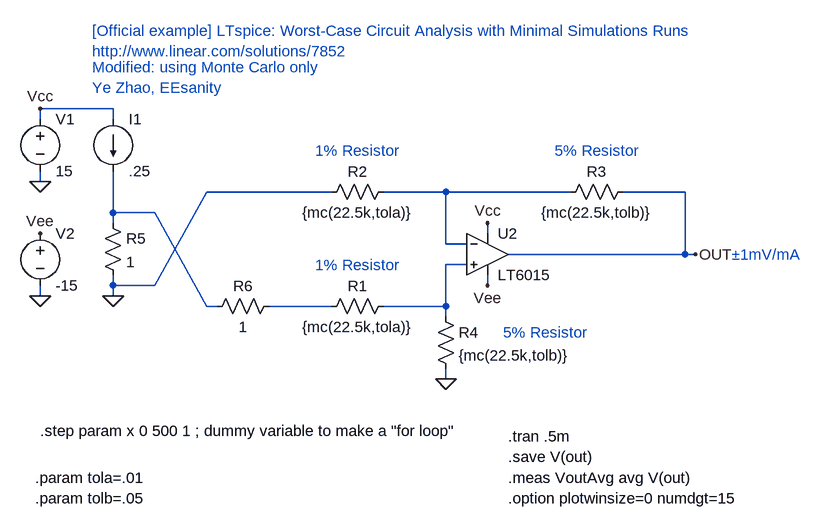
[diagram p0: schematic LTspice 07-3 Monte Carlo.asc]
LTspice 07-3 Monte Carlo.asc, the LTspice schematic file:
Version 4
SHEET 1 1820 680
WIRE -464 -752 -576 -752
WIRE -576 -736 -576 -752
WIRE -464 -736 -464 -752
WIRE -576 -640 -576 -656
WIRE -128 -624 -320 -624
WIRE 48 -624 -48 -624
WIRE 240 -624 48 -624
WIRE 416 -624 320 -624
WIRE -464 -592 -464 -656
WIRE -400 -592 -464 -592
WIRE -464 -576 -464 -592
WIRE 112 -560 112 -576
WIRE 48 -544 48 -624
WIRE 80 -544 48 -544
WIRE 416 -528 416 -624
WIRE 416 -528 144 -528
WIRE 432 -528 416 -528
WIRE 80 -512 48 -512
WIRE -464 -480 -464 -496
WIRE -400 -480 -320 -624
WIRE -400 -480 -464 -480
WIRE 112 -480 112 -496
WIRE -576 -464 -576 -480
WIRE -464 -464 -464 -480
WIRE -320 -448 -400 -592
WIRE -304 -448 -320 -448
WIRE -128 -448 -224 -448
WIRE 48 -448 48 -512
WIRE 48 -448 -48 -448
WIRE 48 -432 48 -448
WIRE 48 -336 48 -352
FLAG 48 -336 0
FLAG 432 -528 OUT
FLAG -576 -464 0
FLAG -576 -640 0
FLAG -576 -752 Vcc
FLAG -576 -560 Vee
FLAG 112 -576 Vcc
FLAG 112 -480 Vee
FLAG -464 -464 0
SYMBOL res -144 -432 R270
WINDOW 0 32 56 VTop 2
WINDOW 3 0 56 VBottom 2
SYMATTR InstName R1
SYMATTR Value {mc(22.5k,tola)}
SYMBOL res 32 -448 R0
SYMATTR InstName R4
SYMATTR Value {mc(22.5k,tolb)}
SYMBOL res 336 -640 R90
WINDOW 0 0 56 VBottom 2
WINDOW 3 32 56 VTop 2
SYMATTR InstName R3
SYMATTR Value {mc(22.5k,tolb)}
SYMBOL res -144 -608 R270
WINDOW 0 32 56 VTop 2
WINDOW 3 0 56 VBottom 2
SYMATTR InstName R2
SYMATTR Value {mc(22.5k,tola)}
SYMBOL Opamps\\LT6015 112 -528 R0
SYMATTR InstName U2
SYMBOL voltage -576 -752 R0
WINDOW 123 0 0 Left 2
WINDOW 39 0 0 Left 2
SYMATTR InstName V1
SYMATTR Value 15
SYMBOL voltage -576 -576 R0
WINDOW 123 0 0 Left 2
WINDOW 39 0 0 Left 2
SYMATTR InstName V2
SYMATTR Value -15
SYMBOL current -464 -736 R0
WINDOW 123 24 122 Left 2
WINDOW 39 24 101 Left 2
SYMATTR InstName I1
SYMATTR Value .25
SYMBOL res -480 -592 R0
SYMATTR InstName R5
SYMATTR Value 1
SYMBOL res -208 -464 R90
WINDOW 0 0 56 VBottom 2
WINDOW 3 32 56 VTop 2
SYMATTR InstName R6
SYMATTR Value 1
TEXT -584 -184 Left 2 !.param tola=.01
TEXT -584 -152 Left 2 !.param tolb=.05
TEXT 144 -248 Left 2 !.tran .5m
TEXT 144 -216 Left 2 !.save V(out)
TEXT 144 -184 Left 2 !.meas VoutAvg avg V(out)
TEXT 144 -152 Left 2 !.option plotwinsize=0 numdgt=15
TEXT 136 -408 Left 2 ;5% Resistor
TEXT 280 -672 Bottom 2 ;5% Resistor
TEXT -88 -672 Bottom 2 ;1% Resistor
TEXT -88 -496 Bottom 2 ;1% Resistor
TEXT 488 -528 Left 2 ;±1mV/mA
TEXT -576 -256 Left 2 !.step param x 0 500 1 ; dummy variable to make a "for loop"
TEXT -496 -872 Left 2 ;[Official example] LTspice: Worst-Case Circuit Analysis with Minimal Simulations Runs \nhttp://www.linear.com/solutions/7852
TEXT -496 -816 Left 2 ;Modified: using Monte Carlo only\nYe Zhao, EEsanity

The netlist it stands for:
* LTspice 07-3 Monte Carlo.asc
R1 N004 N003 {mc(22.5k,tola)}
R4 N003 0 {mc(22.5k,tolb)}
R3 OUT N001 {mc(22.5k,tolb)}
R2 0 N001 {mc(22.5k,tola)}
XU2 N003 N001 Vcc Vee OUT LT6016  ; LT6015, pins In+ In- V+ V- OUT
V1 Vcc 0 15
V2 Vee 0 -15
I1 Vcc N002 .25
R5 N002 0 1
R6 N004 N002 1
.param tola=.01
.param tolb=.05
.tran .5m
.save V(out)
.meas VoutAvg avg V(out)
.option plotwinsize=0 numdgt=15
* 5% Resistor
* 5% Resistor
* 1% Resistor
* 1% Resistor
* ±1mV/mA
.step param x 0 500 1 ; dummy variable to make a "for loop"
* [Official example] LTspice: Worst-Case Circuit Analysis with Minimal Simulations Runs
* http://www.linear.com/solutions/7852
* Modified: using Monte Carlo only
* Ye Zhao, EEsanity
.lib LTC2.lib
.backanno
.end